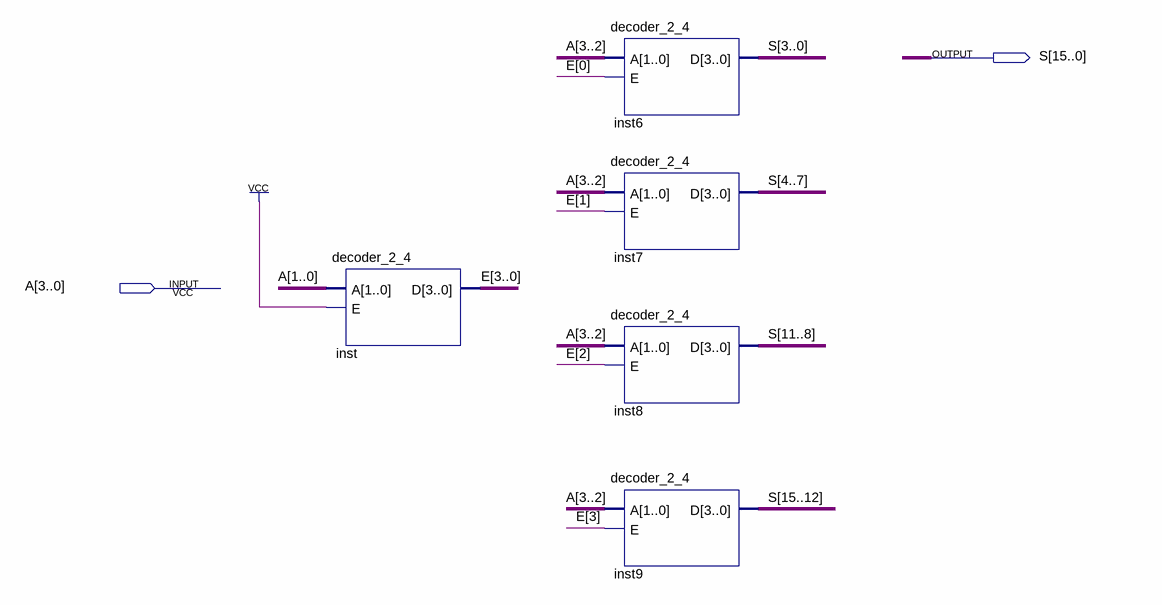
[diagram p0: schematic sheet]
// Quartus schematic decoder_4_16.bdf as structural Verilog: 5 symbols, 2 pins
module decoder_4_16 (
  input  [3:0] A,
  output [15:0] S
);

  wire [3:0] E;

  decoder_2_4 inst (.A(A[1:0]), .E(1'b1), .D(E));
  decoder_2_4 inst6 (.A(A[3:2]), .E(E[0]), .D(S[3:0]));
  decoder_2_4 inst7 (.A(A[3:2]), .E(E[1]), .D({S[4], S[5], S[6], S[7]}));
  decoder_2_4 inst8 (.A(A[3:2]), .E(E[2]), .D(S[11:8]));
  decoder_2_4 inst9 (.A(A[3:2]), .E(E[3]), .D(S[15:12]));
endmodule
